# Altium project EncoderDebouncer.PrjPcb
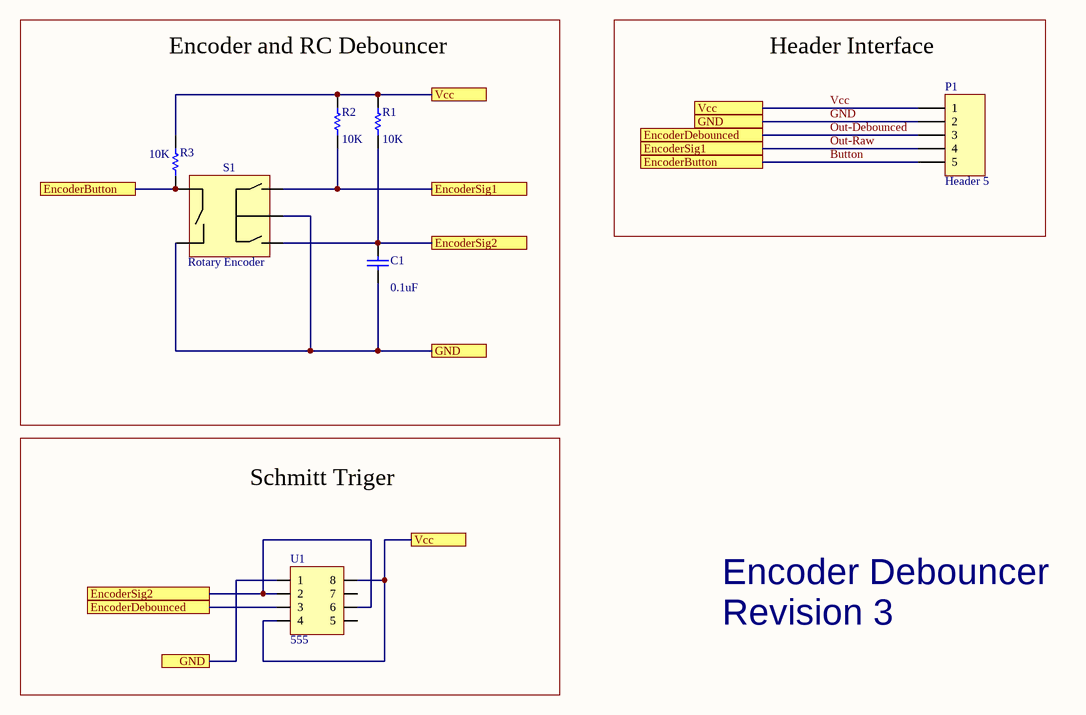
[diagram p0: EncoderDebouncer.SchDoc]
1 sheet, 7 parts. Net scope: flat (ports and power ports of the same name join across sheets).
Board file: EncoderDebouncer.PcbDoc

## Sheet EncoderDebouncer.SchDoc
size Letter; Organization: Altium Limited; Address1: L3, 12a Rodborough Rd; Address2: Frenchs Forest; Address3: NSW; Address4: Australia 2086

### Parts
C1  value 0.1uF  [0805-CAP]  (hidden comment: Cap)
P1  Header 5  [Pin Header 1x5 TH Pitch 2.54mm]
R1  value 10K  [0805-RES]  (hidden comment: Res1)
R2  value 10K  [0805-RES]  (hidden comment: Res1)
R3  value 10K  [0805-RES]  (hidden comment: Res1)
S1  Rotary Encoder
U1  555

### Blocks framed on the sheet
Encoder and RC Debouncer: C1 R1-R3 S1
Header Interface: P1
Schmitt Triger: U1

### Ports
EncoderButton, EncoderDebounced, EncoderSig1, EncoderSig2, GND, Vcc

### Nets
Button: P1.5 R3.1 S1.5 ; port EncoderButton
GND: C1.1 P1.2 S1.2 S1.4 U1.1 ; port GND
Out-Debounced: P1.3 U1.3 ; port EncoderDebounced
Out-Raw: P1.4 R2.1 S1.1 ; port EncoderSig1
Vcc: P1.1 R1.2 R2.2 R3.2 U1.4 U1.8 ; port Vcc
NetC1_2: C1.2 R1.1 S1.3 U1.2 U1.6 ; port EncoderSig2

Not connected (* = marked no-connect by the designer): U1 5 7

### Notes on the sheet
- Encoder Debouncer
- Revision 3
- Title
- Size:
- Date:
- Letter
- Number:
- Time:
- Revision:
- Sheet
- of
- File:

### Library data of the parts
C1 = Cap: Capacitor; Published: 8-Jun-2000; LatestRevisionDate: 17-Jul-2002; LatestRevisionNote: Re-released for DXP Platform.; PackageReference: RAD-0.3; Publisher: Altium Limited; PackageDescription: Radial Cap, Thru-Hole; 2 Leads; 0.3 in Pin Spacing
P1 = Header 5: Header, 5-Pin; LatestRevisionDate: 17-Jul-2002; LatestRevisionNote: Re-released for DXP Platform.; Publisher: Altium Limited
R1-R3 = Res1: Resistor; Published: 8-Jun-2000; LatestRevisionDate: 17-Jul-2002; LatestRevisionNote: Re-released for DXP Platform.; PackageReference: AXIAL-0.3; Publisher: Altium Limited; PackageDescription: Axial Device, Thru-Hole; 2 Leads; 0.3 in Pin Spacing